# Altium project mcHF_ui.PrjPCB
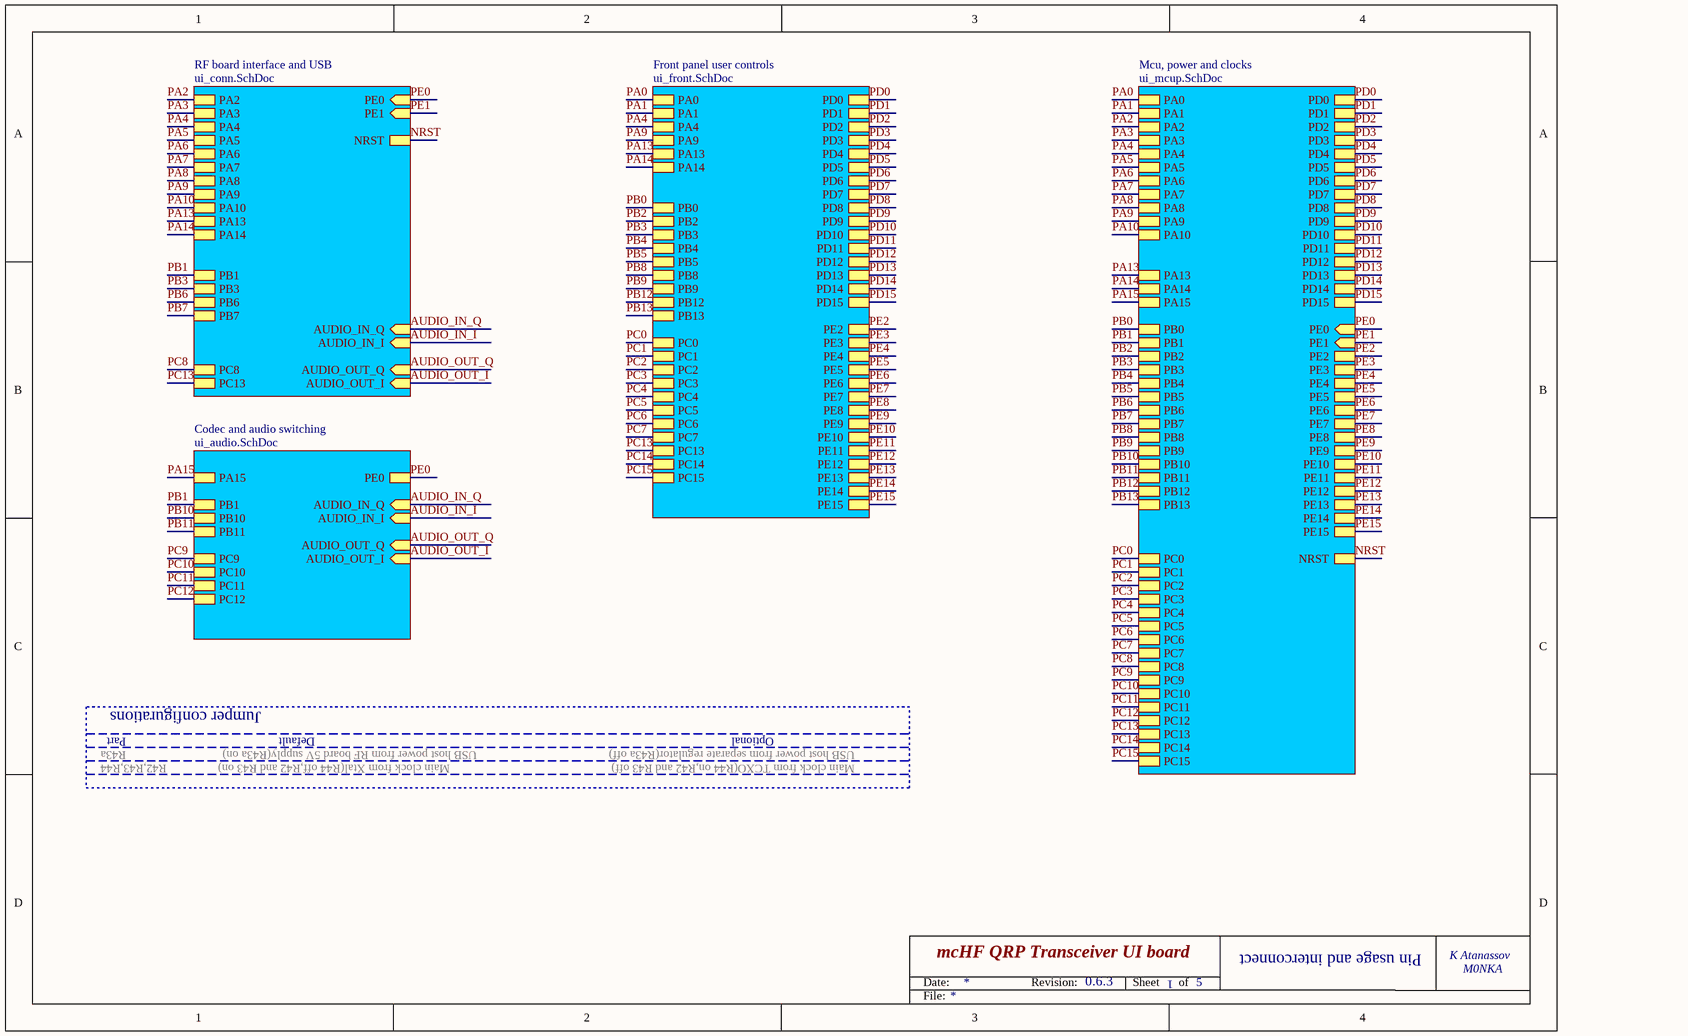
[diagram p0: ui_main.SchDoc]
4 sheets, 126 parts. Net scope: hierarchical (ports join the sheet entries above them; power ports are global).
Board file: ui_main.PcbDoc
Sheets:
  ui_main.SchDoc
    Mcu, power and clocks = ui_mcup.SchDoc
    RF board interface and USB = ui_conn.SchDoc
    Front panel user controls = ui_front.SchDoc

## Sheet ui_main.SchDoc: mcHF QRP Transceiver UI board
size A4; Author: K Atanassov; CompanyName: M0NKA; Revision: 0.6.3; SheetTotal: 5

### Sub-sheets
Codec and audio switching = ui_audio.SchDoc (file not in this document): PA15, PB1, PB10, PB11, PC9, PC11, PC10, PC12, PE0, AUDIO_IN_Q (in), AUDIO_IN_I (in), AUDIO_OUT_Q (in), AUDIO_OUT_I (in)
Front panel user controls = ui_front.SchDoc: PA0, PA1, PB3, PB2, PB0, PB8, PB9, PB12, PB13, PB4, PB5, PC0, PC1, PC2, PC3, PC4, PC5, PC6, PC7, PC13, PC14, PC15, PD0, PD1, PD2, PD3, PD4, PD5, PD6, PD7, PD8, PD9, PD10, PD12, PD11, PD13, PD14, PD15, PE2, PE3, PE4, PE5, PE6, PE7, PE8, PE9, PE10, PE11, PE12, PE13, PE14, PE15, PA13, PA14, PA4, PA9
Mcu, power and clocks = ui_mcup.SchDoc: PD0, PD1, PD2, PD3, PE1 (in), PD4, PD5, PD6, PD7, PD8, PD9, PD10, PD11, PD12, PD13, PD14, PD15, PE2, PE3, PE4, PE5, PE6, PE7, PE8, PE9, PE10, PE11, PE12, PE13, PE14, PE15, PA0, PA1, PA2, PA3, PA4, PA5, PA6, PA7, PA8, PA9, PA10, PA13, PA14, PA15, PE0 (in), PB0, PB1, PB3, PB4, PB5, PB6, PB8, PB7, PB9, PB10, PB11, PB12, PB13, PC1, PC0, PC2, PC3, PC4, PC5, PC6, PC7, PC8, PC9, PC10, PC11, PC12, PC13, PC14, PC15, PB2, NRST
RF board interface and USB = ui_conn.SchDoc: PA3, PA2, PA5, PA6, PA7, PA9, PB1, PA8, PB6, PB7, PC8, PE0 (in), PE1 (in), AUDIO_IN_Q (in), AUDIO_IN_I (in), AUDIO_OUT_Q (in), AUDIO_OUT_I (in), PA10, PC13, PA4, NRST, PA13, PA14, PB3

### Nets
AUDIO_IN_I: sheet Codec and audio switching/AUDIO_IN_I, sheet RF board interface and USB/AUDIO_IN_I
AUDIO_IN_Q: sheet Codec and audio switching/AUDIO_IN_Q, sheet RF board interface and USB/AUDIO_IN_Q
AUDIO_OUT_I: sheet Codec and audio switching/AUDIO_OUT_I, sheet RF board interface and USB/AUDIO_OUT_I
AUDIO_OUT_Q: sheet Codec and audio switching/AUDIO_OUT_Q, sheet RF board interface and USB/AUDIO_OUT_Q
NRST: sheet Mcu, power and clocks/NRST, sheet RF board interface and USB/NRST
PA0: sheet Mcu, power and clocks/PA0, sheet Front panel user controls/PA0
PA1: sheet Mcu, power and clocks/PA1, sheet Front panel user controls/PA1
PA2: sheet Mcu, power and clocks/PA2, sheet RF board interface and USB/PA2
PA3: sheet Mcu, power and clocks/PA3, sheet RF board interface and USB/PA3
PA4: sheet Mcu, power and clocks/PA4, sheet RF board interface and USB/PA4, sheet Front panel user controls/PA4
PA5: sheet Mcu, power and clocks/PA5, sheet RF board interface and USB/PA5
PA6: sheet Mcu, power and clocks/PA6, sheet RF board interface and USB/PA6
PA7: sheet Mcu, power and clocks/PA7, sheet RF board interface and USB/PA7
PA8: sheet Mcu, power and clocks/PA8, sheet RF board interface and USB/PA8
PA9: sheet Mcu, power and clocks/PA9, sheet RF board interface and USB/PA9, sheet Front panel user controls/PA9
PA10: sheet Mcu, power and clocks/PA10, sheet RF board interface and USB/PA10
PA13: sheet Mcu, power and clocks/PA13, sheet RF board interface and USB/PA13, sheet Front panel user controls/PA13
PA14: sheet Mcu, power and clocks/PA14, sheet RF board interface and USB/PA14, sheet Front panel user controls/PA14
PA15: sheet Mcu, power and clocks/PA15, sheet Codec and audio switching/PA15
PB0: sheet Mcu, power and clocks/PB0, sheet Front panel user controls/PB0
PB1: sheet Mcu, power and clocks/PB1, sheet Codec and audio switching/PB1, sheet RF board interface and USB/PB1
PB2: sheet Mcu, power and clocks/PB2, sheet Front panel user controls/PB2
PB3: sheet Mcu, power and clocks/PB3, sheet RF board interface and USB/PB3, sheet Front panel user controls/PB3
PB4: sheet Mcu, power and clocks/PB4, sheet Front panel user controls/PB4
PB5: sheet Mcu, power and clocks/PB5, sheet Front panel user controls/PB5
PB6: sheet Mcu, power and clocks/PB6, sheet RF board interface and USB/PB6
PB7: sheet Mcu, power and clocks/PB7, sheet RF board interface and USB/PB7
PB8: sheet Mcu, power and clocks/PB8, sheet Front panel user controls/PB8
PB9: sheet Mcu, power and clocks/PB9, sheet Front panel user controls/PB9
PB10: sheet Mcu, power and clocks/PB10, sheet Codec and audio switching/PB10
PB11: sheet Mcu, power and clocks/PB11, sheet Codec and audio switching/PB11
PB12: sheet Mcu, power and clocks/PB12, sheet Front panel user controls/PB12
PB13: sheet Mcu, power and clocks/PB13, sheet Front panel user controls/PB13  [project net LCD13]
PC0: sheet Mcu, power and clocks/PC0, sheet Front panel user controls/PC0
PC1: sheet Mcu, power and clocks/PC1, sheet Front panel user controls/PC1
PC2: sheet Mcu, power and clocks/PC2, sheet Front panel user controls/PC2  [project net LCD16]
PC3: sheet Mcu, power and clocks/PC3, sheet Front panel user controls/PC3  [project net LCD17]
PC4: sheet Mcu, power and clocks/PC4, sheet Front panel user controls/PC4
PC5: sheet Mcu, power and clocks/PC5, sheet Front panel user controls/PC5
PC6: sheet Mcu, power and clocks/PC6, sheet Front panel user controls/PC6
PC7: sheet Mcu, power and clocks/PC7, sheet Front panel user controls/PC7
PC8: sheet Mcu, power and clocks/PC8, sheet RF board interface and USB/PC8
PC9: sheet Mcu, power and clocks/PC9, sheet Codec and audio switching/PC9
PC10: sheet Mcu, power and clocks/PC10, sheet Codec and audio switching/PC10
PC11: sheet Mcu, power and clocks/PC11, sheet Codec and audio switching/PC11
PC12: sheet Mcu, power and clocks/PC12, sheet Codec and audio switching/PC12
PC13: sheet Mcu, power and clocks/PC13, sheet RF board interface and USB/PC13, sheet Front panel user controls/PC13
PC14: sheet Mcu, power and clocks/PC14, sheet Front panel user controls/PC14
PC15: sheet Mcu, power and clocks/PC15, sheet Front panel user controls/PC15
PD0: sheet Mcu, power and clocks/PD0, sheet Front panel user controls/PD0
PD1: sheet Mcu, power and clocks/PD1, sheet Front panel user controls/PD1
PD2: sheet Mcu, power and clocks/PD2, sheet Front panel user controls/PD2  [project net LCD40]
PD3: sheet Mcu, power and clocks/PD3, sheet Front panel user controls/PD3  [project net LCD15]
PD4: sheet Mcu, power and clocks/PD4, sheet Front panel user controls/PD4
PD5: sheet Mcu, power and clocks/PD5, sheet Front panel user controls/PD5
PD6: sheet Mcu, power and clocks/PD6, sheet Front panel user controls/PD6
PD7: sheet Mcu, power and clocks/PD7, sheet Front panel user controls/PD7  [project net LCD11]
PD8: sheet Mcu, power and clocks/PD8, sheet Front panel user controls/PD8
PD9: sheet Mcu, power and clocks/PD9, sheet Front panel user controls/PD9
PD10: sheet Mcu, power and clocks/PD10, sheet Front panel user controls/PD10
PD11: sheet Mcu, power and clocks/PD11, sheet Front panel user controls/PD11
PD12: sheet Mcu, power and clocks/PD12, sheet Front panel user controls/PD12
PD13: sheet Mcu, power and clocks/PD13, sheet Front panel user controls/PD13
PD14: sheet Mcu, power and clocks/PD14, sheet Front panel user controls/PD14
PD15: sheet Mcu, power and clocks/PD15, sheet Front panel user controls/PD15
PE0: sheet Mcu, power and clocks/PE0, sheet Codec and audio switching/PE0, sheet RF board interface and USB/PE0
PE1: sheet Mcu, power and clocks/PE1, sheet RF board interface and USB/PE1
PE2: sheet Mcu, power and clocks/PE2, sheet Front panel user controls/PE2
PE3: sheet Mcu, power and clocks/PE3, sheet Front panel user controls/PE3
PE4: sheet Mcu, power and clocks/PE4, sheet Front panel user controls/PE4
PE5: sheet Mcu, power and clocks/PE5, sheet Front panel user controls/PE5
PE6: sheet Mcu, power and clocks/PE6, sheet Front panel user controls/PE6
PE7: sheet Mcu, power and clocks/PE7, sheet Front panel user controls/PE7
PE8: sheet Mcu, power and clocks/PE8, sheet Front panel user controls/PE8
PE9: sheet Mcu, power and clocks/PE9, sheet Front panel user controls/PE9
PE10: sheet Mcu, power and clocks/PE10, sheet Front panel user controls/PE10
PE11: sheet Mcu, power and clocks/PE11, sheet Front panel user controls/PE11
PE12: sheet Mcu, power and clocks/PE12, sheet Front panel user controls/PE12
PE13: sheet Mcu, power and clocks/PE13, sheet Front panel user controls/PE13
PE14: sheet Mcu, power and clocks/PE14, sheet Front panel user controls/PE14
PE15: sheet Mcu, power and clocks/PE15, sheet Front panel user controls/PE15

### Notes on the sheet
- Jumper configurations
- Part
- R43a
- R42,R43,R44
- Default
- Main clock from Xtal(R44 off,R42 and R43 on)
- USB host power from RF board 5V supply(R43a on)
- Optional
- USB host power from separate regulator(R43a off)
- Main clock from TCXO(R44 on,R42 and R43 off)
- 1
- Pin usage and interconnect
- Date:
- Revision:
- Sheet
- of
- File:

## Sheet ui_mcup.SchDoc: mcHF QRP Transceiver UI board
size A4; Author: K Atanassov; CompanyName: M0NKA; Revision: 0.6.3; SheetTotal: 5
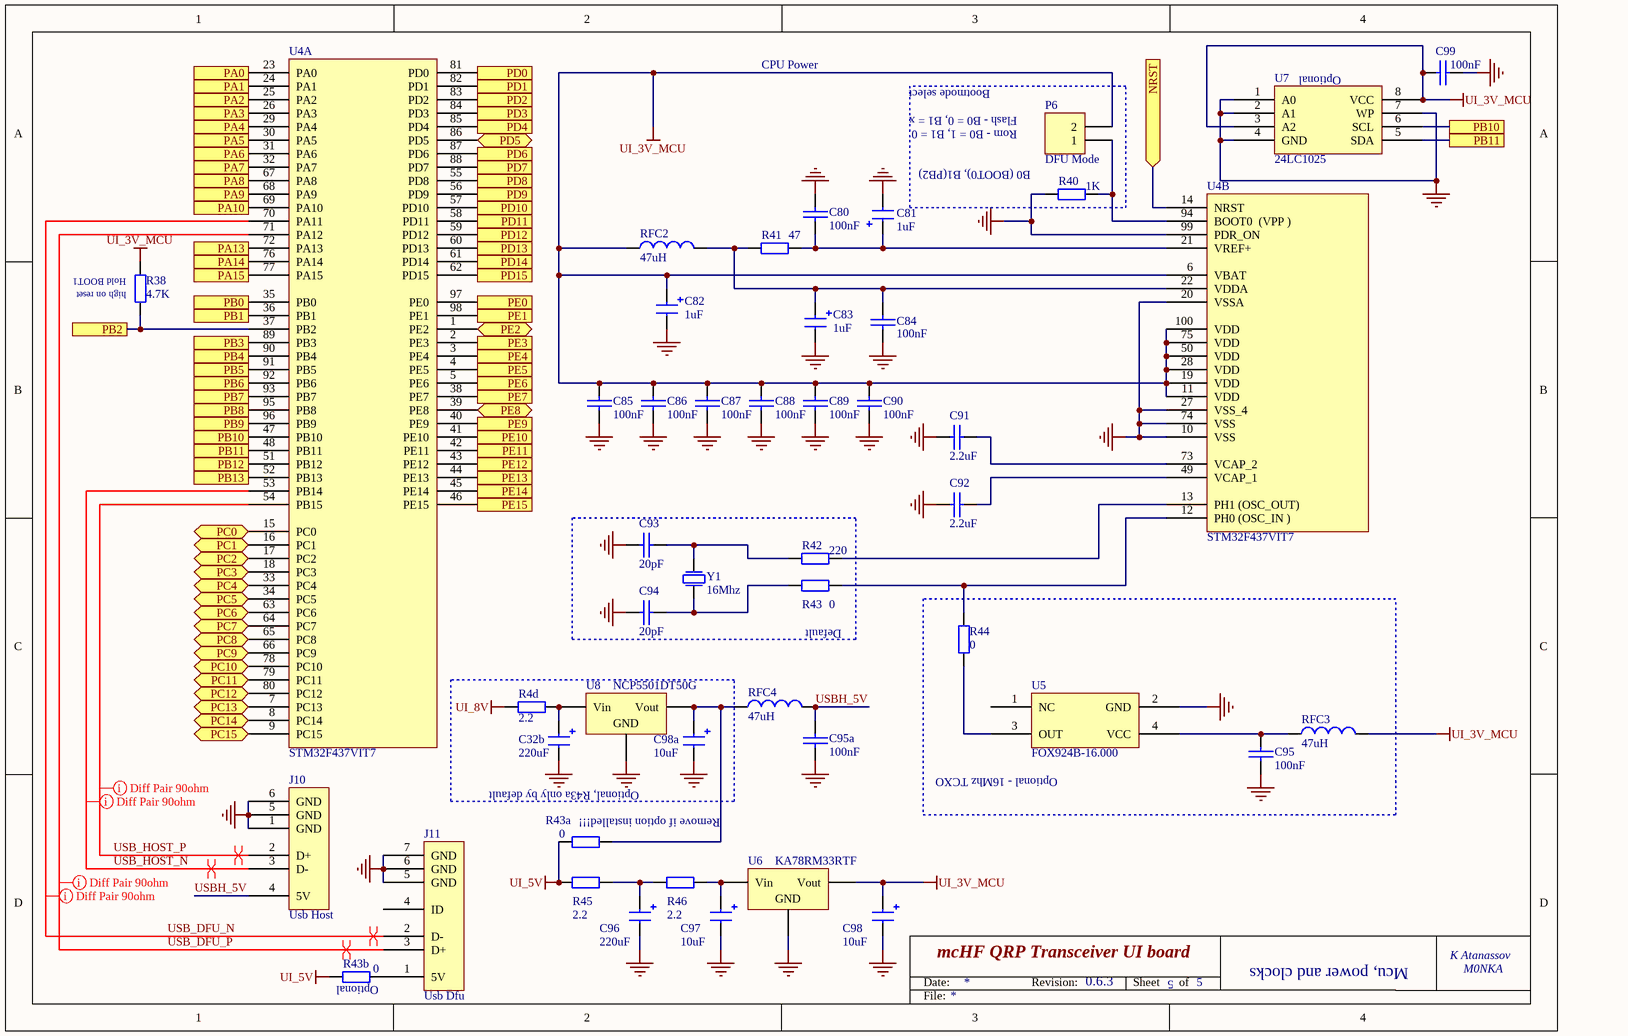
[diagram p1: ui_mcup.SchDoc]

### Parts
C32b  220uF  [CAP_ALUM]  (no BOM)
C80  100nF  [0805-Pro]
C81  1uF  [1206_ELEC_CAP_N]
C82  1uF  [1206_ELEC_CAP_N]
C83  1uF  [1206_ELEC_CAP_N]
C84  100nF  [0805-Pro]
C85  100nF  [0805-Pro]
C86  100nF  [0805-Pro]
C87  100nF  [0805-Pro]
C88  100nF  [0805-Pro]
C89  100nF  [0805-Pro]
C90  100nF  [0805-Pro]
C91  2.2uF  [0805-Pro]
C92  2.2uF  [0805-Pro]
C93  20pF  [0805-Pro]
C94  20pF  [0805-Pro]
C95  100nF  [0805-Pro]  (no BOM)
C95a  100nF  [0805-Pro]
C96  220uF  [CAP_ALUM]
C97  10uF  [1206_ELEC_CAP_N]
C98  10uF  [1206_ELEC_CAP_N]
C98a  10uF  [1206_ELEC_CAP_N]  (no BOM)
C99  100nF  [0805-Pro]
J10  Usb Host  [USB_OUT_A]
J11  Usb Dfu  [MINI_USB_B_SMD]
P6  DFU Mode  [SIP2]
R4d  2.2  [1206]  (no BOM)
R38  4.7K  [0805-Pro]
R40  1K  [0805-Pro]
R41  47  [0805-Pro]
R42  220  [0805-Pro]
R43  0  [0805-Pro]
R43a  0  [0805-Pro]
R43b  0  [0805-Pro]
R44  0  [0805-Pro]  (no BOM)
R45  2.2  [1206]
R46  2.2  [1206]
RFC2  47uH  [0805-Pro]
RFC3  47uH  [0805-Pro]  (no BOM)
RFC4  47uH  [0805-Pro]
U4  STM32F437VIT7  [SQFP14X14-100-Pro]  (parts A,B of 2)
U5  FOX924B-16.000  [2SMX-3SMXB]  (no BOM)
U6  KA78RM33RTF  [TO-252]
U7  24LC1025  [SO-8-Pro]
U8  NCP5501DT50G  [TO-252]  (no BOM)
Y1  16Mhz  [HC49/4H_SMX]

### Blocks framed on the sheet
Default: C93 C94 R42 R43 Y1
Optional - 16Mhz TCXO: C95 R44 RFC3 U5
Optional, R43a only by default: C32b C98a R4d U8

### Ports
NRST (in), PA0, PA1, PA2, PA3, PA4, PA5, PA6, PA7, PA8, PA9, PA10, PA13, PA14, PA15, PB0, PB1, PB2, PB3, PB4, PB5, PB6, PB7, PB8, PB9, PB10, PB11, PB12, PB13, PC0 (bidir), PC1 (bidir), PC2 (bidir), PC3 (bidir), PC4 (bidir), PC5 (bidir), PC6 (bidir), PC7 (bidir), PC8 (bidir), PC9 (bidir), PC10 (bidir), PC11 (bidir), PC12 (bidir), PC13 (bidir), PC14 (bidir), PC15 (bidir), PD0, PD1, PD2, PD3, PD4, PD5 (bidir), PD6, PD7, PD8, PD9, PD10, PD11, PD12, PD13, PD14, PD15, PE0, PE1, PE2 (bidir), PE3, PE4, PE5, PE6, PE7, PE8 (bidir), PE9, PE10, PE11, PE12, PE13, PE14, PE15

### Nets
GND: C32b.2 C80.2 C81.2 C82.2 C83.2 C84.1 C85.1 C86.1 C87.1 C88.1 C89.1 C90.1 C91.1 C92.1 C93.1 C94.1 C95.1 C95a.1 C96.2 C97.2 C98.2 C98a.2 C99.2 J10.1(GND) J10.5(GND) J10.6(GND) J11.5(GND) J11.6(GND) J11.7(GND) R40.1 U4.10(VSS) U4.20(VSSA) U4.27(VSS_4) U4.74(VSS) U4.99(PDR_ON) U5.2(GND) U6.2(GND) U7.1(A0) U7.2(A1) U7.4(GND) U7.7(WP) U8.2(GND)
UI_3V_MCU: C82.1 C85.2 C86.2 C87.2 C88.2 C89.2 C90.2 C98.1 C99.1 P6.2 R38.1 RFC2.1 RFC3.2 U4.6(VBAT) U4.11(VDD) U4.19(VDD) U4.28(VDD) U4.50(VDD) U4.75(VDD) U4.100(VDD) U6.3(Vout) U7.3(A2) U7.8(VCC)
UI_5V: R43a.1 R43b.1 R45.1
UI_8V: R4d.1
LCD11: U4.88(PD7) ; port PD7
LCD13: U4.52(PB13) ; port PB13
LCD15: U4.84(PD3) ; port PD3
LCD16: U4.17(PC2) ; port PC2
LCD17: U4.18(PC3) ; port PC3
LCD40: U4.83(PD2) ; port PD2
NRST: U4.14(NRST) ; port NRST
PA0: U4.23(PA0) ; port PA0
PA1: U4.24(PA1) ; port PA1
PA2: U4.25(PA2) ; port PA2
PA3: U4.26(PA3) ; port PA3
PA4: U4.29(PA4) ; port PA4
PA5: U4.30(PA5) ; port PA5
PA6: U4.31(PA6) ; port PA6
PA7: U4.32(PA7) ; port PA7
PA8: U4.67(PA8) ; port PA8
PA9: U4.68(PA9) ; port PA9
PA10: U4.69(PA10) ; port PA10
PA13: U4.72(PA13) ; port PA13
PA14: U4.76(PA14) ; port PA14
PA15: U4.77(PA15) ; port PA15
PB0: U4.35(PB0) ; port PB0
PB1: U4.36(PB1) ; port PB1
PB2: R38.2 U4.37(PB2) ; port PB2
PB3: U4.89(PB3) ; port PB3
PB4: U4.90(PB4) ; port PB4
PB5: U4.91(PB5) ; port PB5
PB6: U4.92(PB6) ; port PB6
PB7: U4.93(PB7) ; port PB7
PB8: U4.95(PB8) ; port PB8
PB9: U4.96(PB9) ; port PB9
PB10: U4.47(PB10) U7.6(SCL) ; port PB10
PB11: U4.48(PB11) U7.5(SDA) ; port PB11
PB12: U4.51(PB12) ; port PB12
PC0: U4.15(PC0) ; port PC0
PC1: U4.16(PC1) ; port PC1
PC4: U4.33(PC4) ; port PC4
PC5: U4.34(PC5) ; port PC5
PC6: U4.63(PC6) ; port PC6
PC7: U4.64(PC7) ; port PC7
PC8: U4.65(PC8) ; port PC8
PC9: U4.66(PC9) ; port PC9
PC10: U4.78(PC10) ; port PC10
PC11: U4.79(PC11) ; port PC11
PC12: U4.80(PC12) ; port PC12
PC13: U4.7(PC13) ; port PC13
PC14: U4.8(PC14) ; port PC14
PC15: U4.9(PC15) ; port PC15
PD0: U4.81(PD0) ; port PD0
PD1: U4.82(PD1) ; port PD1
PD4: U4.85(PD4) ; port PD4
PD5: U4.86(PD5) ; port PD5
PD6: U4.87(PD6) ; port PD6
PD8: U4.55(PD8) ; port PD8
PD9: U4.56(PD9) ; port PD9
PD10: U4.57(PD10) ; port PD10
PD11: U4.58(PD11) ; port PD11
PD12: U4.59(PD12) ; port PD12
PD13: U4.60(PD13) ; port PD13
PD14: U4.61(PD14) ; port PD14
PD15: U4.62(PD15) ; port PD15
PE0: U4.97(PE0) ; port PE0
PE1: U4.98(PE1) ; port PE1
PE2: U4.1(PE2) ; port PE2
PE3: U4.2(PE3) ; port PE3
PE4: U4.3(PE4) ; port PE4
PE5: U4.4(PE5) ; port PE5
PE6: U4.5(PE6) ; port PE6
PE7: U4.38(PE7) ; port PE7
PE8: U4.39(PE8) ; port PE8
PE9: U4.40(PE9) ; port PE9
PE10: U4.41(PE10) ; port PE10
PE11: U4.42(PE11) ; port PE11
PE12: U4.43(PE12) ; port PE12
PE13: U4.44(PE13) ; port PE13
PE14: U4.45(PE14) ; port PE14
PE15: U4.46(PE15) ; port PE15
USB_DFU_N: J11.2(D-) U4.70(PA11)
USB_DFU_P: J11.3(D+) U4.71(PA12)
USB_HOST_N: J10.3(D-) U4.53(PB14)
USB_HOST_P: J10.2(D+) U4.54(PB15)
USBH_5V: C95a.2 J10.4(5V) RFC4.2
NetC32b_1: C32b.1 R4d.2 U8.1(Vin)
NetC80_1: C80.1 C81.1 R41.2 U4.21(VREF+)
NetC83_1: C83.1 C84.2 R41.1 RFC2.2 U4.22(VDDA)
NetC91_2: C91.2 U4.73(VCAP_2)
NetC92_2: C92.2 U4.49(VCAP_1)
NetC93_2: C93.2 R42.1 Y1.1(P1)
NetC94_2: C94.2 R43.1 Y1.2(P2)
NetC95_2: C95.2 RFC3.1 U5.4(VCC)
NetC96_1: C96.1 R45.2 R46.1
NetC97_1: C97.1 R46.2 U6.1(Vin)
NetC98a_1: C98a.1 R43a.2 RFC4.1 U8.3(Vout)
NetJ11_1: J11.1(5V) R43b.2
NetP6_1: P6.1 R40.2 U4.94(BOOT0__(VPP_))
NetR42_2: R42.2 U4.13(PH1_(OSC_OUT))
NetR43_2: R43.2 R44.2 U4.12(PH0_(OSC_IN_))
NetR44_1: R44.1 U5.3(OUT)

Not connected (* = marked no-connect by the designer): J11 4(ID); U5 1(NC)

### Layout directives
differential pair: USB_DFU_N, USB_DFU_P, USB_HOST_N, USB_HOST_P
rule Matched Net Lengths [Tolerance = 150mil]: USB_DFU_N, USB_DFU_P, USB_HOST_N, USB_HOST_P

### Notes on the sheet
- CPU Power
- Bootmode select
- Flash - B0 = 0, B1 = x
- (near U7) Optional
- Rom - B0 = 1, B1 = 0
- B0 (BOOT0), B1(PB2)
- (near R38) Hold BOOT1
- (near R38) high on reset
- (near R43a) Remove if option installed!!!
- (near R43b) Optional
- 5
- Mcu, power and clocks
- Date:
- Revision:
- Sheet
- of
- File:

### Library data of the parts
C32b C96 = CAP-POL: Electrolitic capacitor; Order: FN 225-4321; QT Order: QCC-00320; Price: 0.34
C80 C84-C90 C95 C95a C99 = CAP: Capacitor; Order: FN 174-0673; QT Order: QCC-00154; Price: 0.068
C81-C83 = CAP-POL: Electrolitic capacitor; Order: FN 145-7406; QT Order: QCC-00165; Price: 0.235
C91 C92 = CAP: Capacitor; Order: FN 184-5751; QT Order: QCC-00103; Price: 0.115
C93 C94 = CAP: Capacitor; Order: FN 233-2762; Checked: NA; Price: 0.094
C97 C98 C98a = CAP-POL: Electrolitic capacitor; Order: FN 233-3009; QT Order: QCC-00166; Price: 0.204
J10 = USB_OUT: USB Host Connector; Order: FN 117-7883; Price: 0.60
J11 = MINI_USB_B: Mini USB connector; Order: FN 211-2367; QT Order: QCJ-00083; Price: 0.62
P6 = Header 2: Header, 2-Pin; Order: NA; Price: 0; Checked: NA
R4d R45 R46 = RES: Resistor; Order: FN 207-8984; QT Order: QCR-00412; Price: 0.02
R38 = RES: Resistor; Order: FN 200-8383; QT Order: QCR-00341; Price: 0.024
R40 = RES: Resistor; Order: FN 157-6459; QT Order: QCR-00326; Price: 0.061
R41 = RES: Resistor; Order: FN 173-8942; QT Order: QCR-00293; Price: 0.052
R42 = RES: Resistor; Order: FN 933-2804; QT Order: QCR-00309; Price: 0.007
R43 R43a R43b R44 = RES: Resistor; Order: FN 933-3681; QT Order: QCR-00268; Price: 0.009
RFC2-RFC4 = Inductor: Order: FN 166-9895; Price: 0.16
U4 = STM32F40x-VG: STM32F4 controller; Order: FN 233-3297; Price: 8.07
U5 = FOX924B-16.000: TCXO; Order: FN 206-3959; Price: 2.77
U6 = UA78M33CKVURG3: VOLT REG, 3.3V, TO-252; Order: FN 245-1041; Price: 0.39
U7 = 24LC01B: 1K I2C Eeprom; Order: FN 133-1323; QT Order: QCI-00053; Price: 2.81
U8 = MC7805BTG: VOLTAGE REG, 40V, TO220-3; Order: FN 170-3369; Price: 0.53
Y1 = XTAL: Crystal Oscillator; Order: FN 971-3808; Checked: NA; Price: 0.51

## Sheet ui_conn.SchDoc: mcHF QRP Transceiver UI board
size A4; Author: K Atanassov; CompanyName: M0NKA; Revision: 0.6.3; SheetTotal: 5
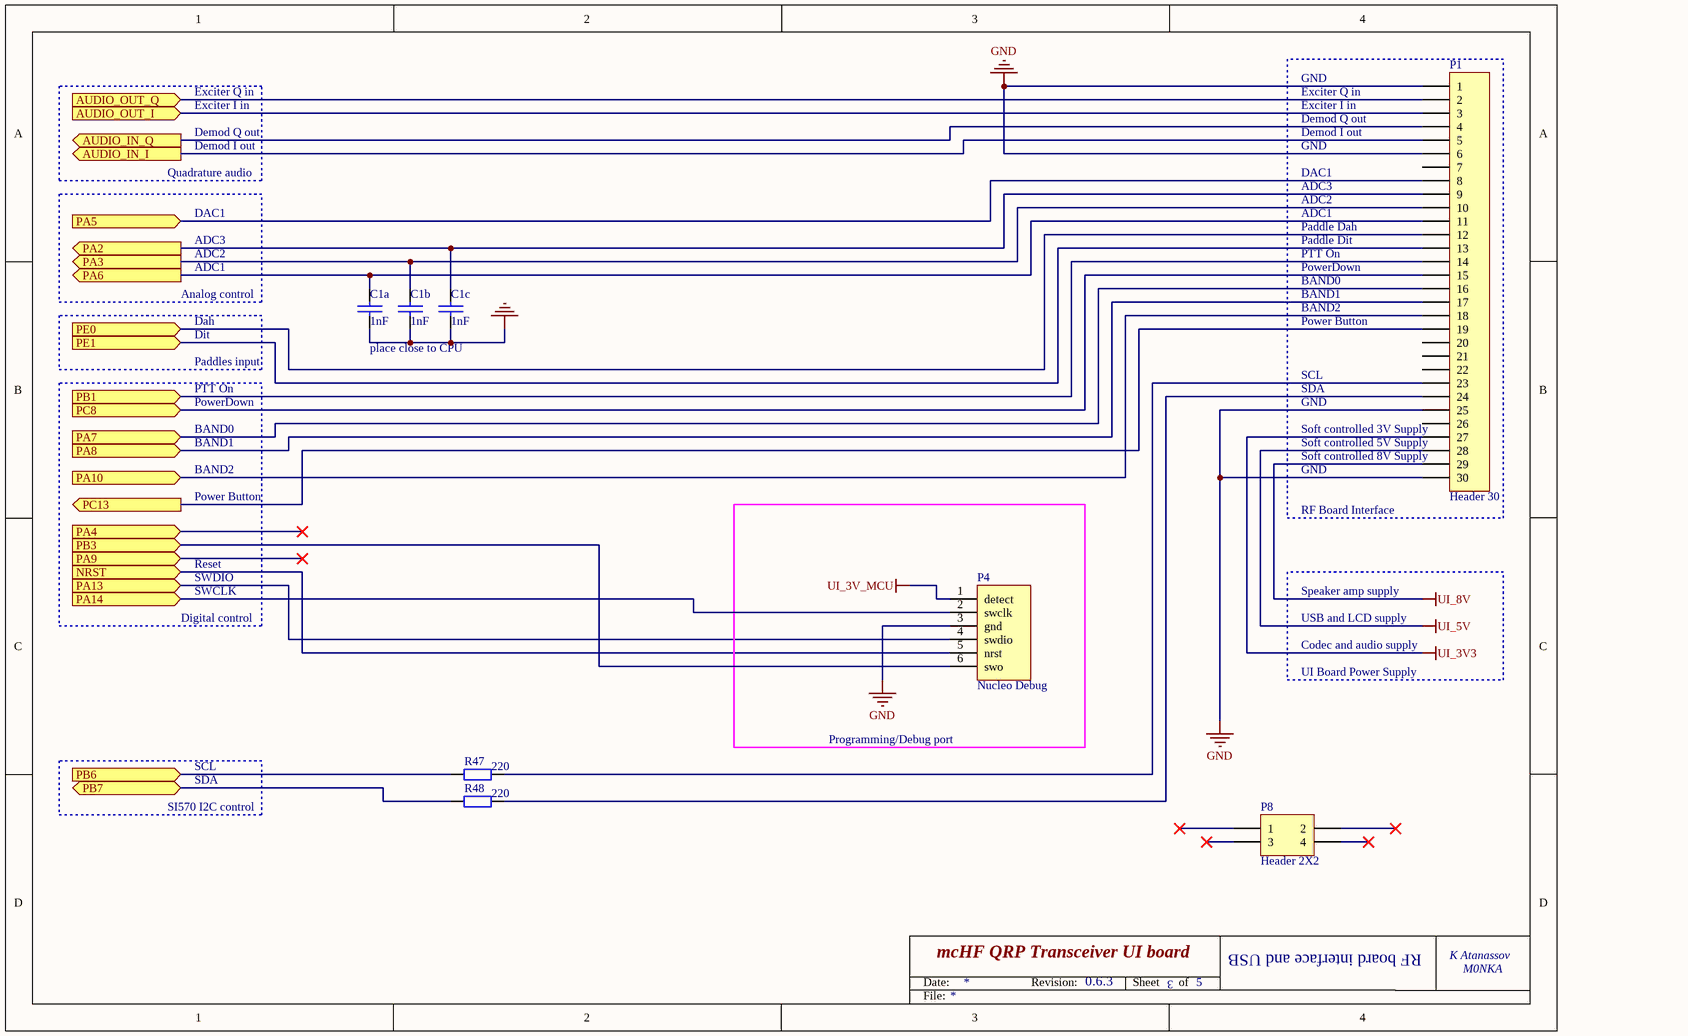
[diagram p2: ui_conn.SchDoc]

### Parts
C1a  1nF  [0805-Pro]
C1b  1nF  [0805-Pro]
C1c  1nF  [0805-Pro]
P1  Header 30  [HDR1X30]
P4  Nucleo Debug  [HDR1X6]  (no BOM)
P8  Header 2X2  [HDR2X2]
R47  220  [0805-Pro]
R48  220  [0805-Pro]

### Blocks framed on the sheet
Programming/Debug port: P4

### Ports
AUDIO_IN_I (out), AUDIO_IN_Q (out), AUDIO_OUT_I (in), AUDIO_OUT_Q (in), NRST (in), PA2 (out), PA3 (out), PA4 (in), PA5 (in), PA6 (out), PA7 (in), PA8 (in), PA9 (in), PA10 (in), PA13 (in), PA14 (in), PB1 (in), PB3 (in), PB6 (in), PB7 (bidir), PC8 (in), PC13 (out), PE0 (in), PE1 (in)

### Nets
GND: C1a.2 C1b.2 C1c.2 P1.1 P1.6 P1.25 P1.30 P4.3(gnd)
UI_3V3: P1.27
UI_3V_MCU: P4.1(detect)
UI_5V: P1.28
UI_8V: P1.29
AUDIO_IN_I: P1.5 ; port AUDIO_IN_I
AUDIO_IN_Q: P1.4 ; port AUDIO_IN_Q
AUDIO_OUT_I: P1.3 ; port AUDIO_OUT_I
AUDIO_OUT_Q: P1.2 ; port AUDIO_OUT_Q
NRST: P4.5(nrst) ; port NRST
PA2: C1c.1 P1.9 ; port PA2
PA3: C1b.1 P1.10 ; port PA3
PA5: P1.8 ; port PA5
PA6: C1a.1 P1.11 ; port PA6
PA7: P1.16 ; port PA7
PA8: P1.17 ; port PA8
PA10: P1.18 ; port PA10
PA13: P4.4(swdio) ; port PA13
PA14: P4.2(swclk) ; port PA14
PB1: P1.14 ; port PB1
PB3: P4.6(swo) ; port PB3
PB6: R47.1 ; port PB6
PB7: R48.1 ; port PB7
PC8: P1.15 ; port PC8
PC13: P1.19 ; port PC13
PE0: P1.12 ; port PE0
PE1: P1.13 ; port PE1
NetP1_23: P1.23 R47.2
NetP1_24: P1.24 R48.2

Not connected (* = marked no-connect by the designer): P1 7 20 21 22 26; P8 1* 2* 3* 4*

### Notes on the sheet
- Exciter Q in
- Exciter I in
- GND
- Quadrature audio
- Demod Q out
- Demod I out
- DAC1
- ADC3
- ADC2
- ADC1
- Paddle Dit
- Paddle Dah
- Analog control
- PTT On
- PowerDown
- BAND0
- BAND1
- BAND2
- Dit
- Dah
- Paddles input
- place close to CPU
- SCL
- Power Button
- SDA
- (near P1) Soft controlled 3V Supply
- (near P1) Soft controlled 5V Supply
- (near P1) RF Board Interface
- (near P1) Soft controlled 8V Supply
- SWDIO
- Reset
- Digital control
- SWCLK
- Speaker amp supply
- USB and LCD supply
- Codec and audio supply
- UI Board Power Supply
- SI570 I2C control
- 3
- RF board interface and USB
- Date:
- Revision:
- Sheet
- of
- File:

### Library data of the parts
C1a C1b C1c = CAP: Capacitor; Order: FN 185-6408; QT Order: QCC-00259; Price: 0.01
P1 = Header 30: Header, 30-Pin; Order: NA; Price: 0.295
P4 = Nucleo_6: ST Nucleo 6 pin header
P8 = Header 2X2: Header, 2-Pin, Dual row; LatestRevisionDate: 17-Jul-2002; LatestRevisionNote: Re-released for DXP Platform.; Publisher: Altium Limited
R47 R48 = RES: as R42 on sheet ui_mcup; Price: 0.007

## Sheet ui_front.SchDoc: mcHF QRP Transceiver UI board
size A4; Author: K Atanassov; CompanyName: M0NKA; Revision: 0.6.3; SheetTotal: 5
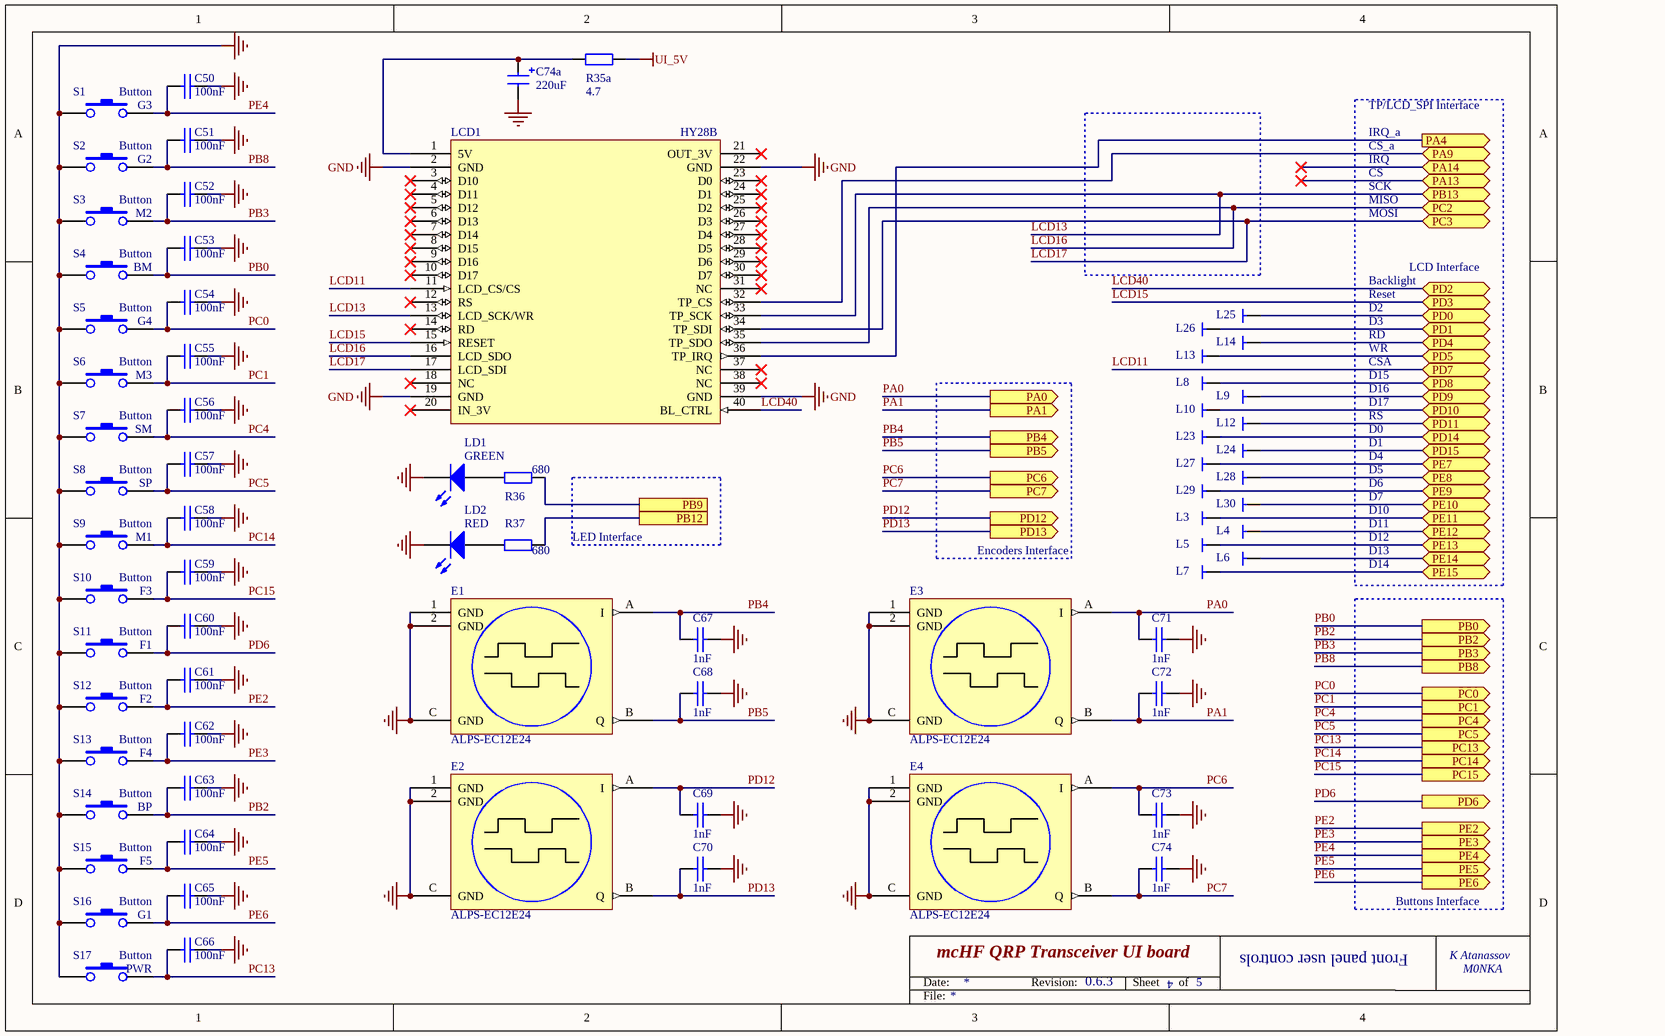
[diagram p3: ui_front.SchDoc]

### Parts
C50  100nF  [0805-Pro]
C51  100nF  [0805-Pro]
C52  100nF  [0805-Pro]
C53  100nF  [0805-Pro]
C54  100nF  [0805-Pro]
C55  100nF  [0805-Pro]
C56  100nF  [0805-Pro]
C57  100nF  [0805-Pro]
C58  100nF  [0805-Pro]
C59  100nF  [0805-Pro]
C60  100nF  [0805-Pro]
C61  100nF  [0805-Pro]
C62  100nF  [0805-Pro]
C63  100nF  [0805-Pro]
C64  100nF  [0805-Pro]
C65  100nF  [0805-Pro]
C66  100nF  [0805-Pro]
C67  1nF  [0805-Pro]
C68  1nF  [0805-Pro]
C69  1nF  [0805-Pro]
C70  1nF  [0805-Pro]
C71  1nF  [0805-Pro]
C72  1nF  [0805-Pro]
C73  1nF  [0805-Pro]
C74  1nF  [0805-Pro]
C74a  220uF  [CAP_ALUM]
E1  ALPS-EC12E24  [Encoder]
E2  ALPS-EC12E24  [Encoder]
E3  ALPS-EC12E24  [Encoder]
E4  ALPS-EC12E24  [Encoder]
L3  TP  [tp]  (value not drawn)  (no BOM)
L4  TP  [tp]  (value not drawn)  (no BOM)
L5  TP  [tp]  (value not drawn)  (no BOM)
L6  TP  [tp]  (value not drawn)  (no BOM)
L7  TP  [tp]  (value not drawn)  (no BOM)
L8  TP  [tp]  (value not drawn)  (no BOM)
L9  TP  [tp]  (value not drawn)  (no BOM)
L10  TP  [tp]  (value not drawn)  (no BOM)
L12  TP  [tp]  (value not drawn)  (no BOM)
L13  TP  [tp]  (value not drawn)  (no BOM)
L14  TP  [tp]  (value not drawn)  (no BOM)
L23  TP  [tp]  (value not drawn)  (no BOM)
L24  TP  [tp]  (value not drawn)  (no BOM)
L25  TP  [tp]  (value not drawn)  (no BOM)
L26  TP  [tp]  (value not drawn)  (no BOM)
L27  TP  [tp]  (value not drawn)  (no BOM)
L28  TP  [tp]  (value not drawn)  (no BOM)
L29  TP  [tp]  (value not drawn)  (no BOM)
L30  TP  [tp]  (value not drawn)  (no BOM)
LCD1  HY28B  [HY28A]  (no BOM)
LD1  GREEN  [LED2n]
LD2  RED  [LED2n]
R35a  4.7  [1206]
R36  680  [0805-Pro]
R37  680  [0805-Pro]
S1  Button  Software function: G3  [BUTTON_SMD2]
S2  Button  Software function: G2  [BUTTON_SMD2]
S3  Button  Software function: M2  [BUTTON_SMD2]
S4  Button  Software function: BM  [BUTTON_SMD2]
S5  Button  Software function: G4  [BUTTON_SMD2]
S6  Button  Software function: M3  [BUTTON_SMD2]
S7  Button  Software function: SM  [BUTTON_SMD2]
S8  Button  Software function: SP  [BUTTON_SMD2]
S9  Button  Software function: M1  [BUTTON_SMD2]
S10  Button  Software function: F3  [BUTTON_SMD2]
S11  Button  Software function: F1  [BUTTON_SMD2]
S12  Button  Software function: F2  [BUTTON_SMD2]
S13  Button  Software function: F4  [BUTTON_SMD2]
S14  Button  Software function: BP  [BUTTON_SMD2]
S15  Button  Software function: F5  [BUTTON_SMD2]
S16  Button  Software function: G1  [BUTTON_SMD2]
S17  Button  Software function: PWR  [BUTTON_SMD2]

### Ports
PA0 (out), PA1 (out), PA4 (out), PA9 (bidir), PA13 (bidir), PA14 (bidir), PB0 (out), PB2 (out), PB3 (out), PB4 (out), PB5 (out), PB8 (out), PB9, PB12, PB13 (bidir), PC0 (out), PC1 (out), PC2 (bidir), PC3 (bidir), PC4 (out), PC5 (out), PC6 (out), PC7 (out), PC13 (out), PC14 (out), PC15 (out), PD0 (bidir), PD1 (bidir), PD2 (bidir), PD3 (bidir), PD4 (bidir), PD5 (bidir), PD6 (out), PD7 (bidir), PD8 (bidir), PD9 (bidir), PD10 (bidir), PD11 (bidir), PD12 (out), PD13 (out), PD14 (bidir), PD15 (bidir), PE2 (out), PE3 (out), PE4 (out), PE5 (out), PE6 (out), PE7 (bidir), PE8 (bidir), PE9 (bidir), PE10 (bidir), PE11 (bidir), PE12 (bidir), PE13 (bidir), PE14 (bidir), PE15 (bidir)

### Nets
GND: C50.1 C51.1 C52.1 C53.1 C54.1 C55.1 C56.1 C57.1 C58.1 C59.1 C60.1 C61.1 C62.1 C63.1 C64.1 C65.1 C66.1 C67.2 C68.2 C69.2 C70.2 C71.2 C72.2 C73.2 C74.2 C74a.2 E1.1(GND) E1.2(GND) E1.C(GND) E2.1(GND) E2.2(GND) E2.C(GND) E3.1(GND) E3.2(GND) E3.C(GND) E4.1(GND) E4.2(GND) E4.C(GND) LCD1.2(GND) LCD1.19(GND) LCD1.22(GND) LCD1.39(GND) LD1.2(K) LD2.2(K) S1.1 S2.1 S3.1 S4.1 S5.1 S6.1 S7.1 S8.1 S9.1 S10.1 S11.1 S12.1 S13.1 S14.1 S15.1 S16.1 S17.1
UI_5V: R35a.1
LCD11: LCD1.11(LCD_CS/CS) ; port PD7
LCD13: LCD1.13(LCD_SCK/WR) LCD1.33(TP_SCK) ; port PB13
LCD15: LCD1.15(RESET) ; port PD3
LCD16: LCD1.16(LCD_SDO) LCD1.35(TP_SDO) ; port PC2
LCD17: LCD1.17(LCD_SDI) LCD1.34(TP_SDI) ; port PC3
LCD40: LCD1.40(BL_CTRL) ; port PD2
PA0: C71.1 E3.A(I) ; port PA0
PA1: C72.1 E3.B(Q) ; port PA1
PA4: LCD1.36(TP_IRQ) ; port PA4
PA9: LCD1.32(TP_CS) ; port PA9
PB0: C53.2 S4.2 ; port PB0
PB2: C63.2 S14.2 ; port PB2
PB3: C52.2 S3.2 ; port PB3
PB4: C67.1 E1.A(I) ; port PB4
PB5: C68.1 E1.B(Q) ; port PB5
PB8: C51.2 S2.2 ; port PB8
PB9: R36.2 ; port PB9
PB12: R37.2 ; port PB12
PC0: C54.2 S5.2 ; port PC0
PC1: C55.2 S6.2 ; port PC1
PC4: C56.2 S7.2 ; port PC4
PC5: C57.2 S8.2 ; port PC5
PC6: C73.1 E4.A(I) ; port PC6
PC7: C74.1 E4.B(Q) ; port PC7
PC13: C66.2 S17.2 ; port PC13
PC14: C58.2 S9.2 ; port PC14
PC15: C59.2 S10.2 ; port PC15
PD0: L25.1 ; port PD0
PD1: L26.1 ; port PD1
PD4: L14.1 ; port PD4
PD5: L13.1 ; port PD5
PD6: C60.2 S11.2 ; port PD6
PD8: L8.1 ; port PD8
PD9: L9.1 ; port PD9
PD10: L10.1 ; port PD10
PD11: L12.1 ; port PD11
PD12: C69.1 E2.A(I) ; port PD12
PD13: C70.1 E2.B(Q) ; port PD13
PD14: L23.1 ; port PD14
PD15: L24.1 ; port PD15
PE2: C61.2 S12.2 ; port PE2
PE3: C62.2 S13.2 ; port PE3
PE4: C50.2 S1.2 ; port PE4
PE5: C64.2 S15.2 ; port PE5
PE6: C65.2 S16.2 ; port PE6
PE7: L27.1 ; port PE7
PE8: L28.1 ; port PE8
PE9: L29.1 ; port PE9
PE10: L30.1 ; port PE10
PE11: L3.1 ; port PE11
PE12: L4.1 ; port PE12
PE13: L5.1 ; port PE13
PE14: L6.1 ; port PE14
PE15: L7.1 ; port PE15
NetC74a_1: C74a.1 LCD1.1(5V) R35a.2
NetLD1_1: LD1.1(A) R36.1
NetLD2_1: LD2.1(A) R37.1

Not connected (* = marked no-connect by the designer): LCD1 3(D10)* 4(D11)* 5(D12)* 6(D13)* 7(D14)* 8(D15)* 9(D16)* 10(D17)* 12(RS)* 14(RD)* 18(NC)* 20(IN_3V)* 21(OUT_3V)* 23(D0)* 24(D1)* 25(D2)* 26(D3)* 27(D4)* 28(D5)* 29(D6)* 30(D7)* 31(NC)* 37(NC)* 38(NC)*

### Notes on the sheet
- TP/LCD_SPI Interface
- IRQ
- CS
- IRQ_a
- CS_a
- MISO
- MOSI
- SCK
- D2
- Backlight
- Reset
- LCD Interface
- D15
- CSA
- WR
- RD
- D3
- D16
- D17
- RS
- D0
- D1
- D10
- D4
- D5
- D6
- D7
- (near R37) LED Interface
- Encoders Interface
- D12
- D11
- D13
- D14
- Buttons Interface
- 4
- Front panel user controls
- Date:
- Revision:
- Sheet
- of
- File:

### Library data of the parts
C50-C66 = CAP: as C80 on sheet ui_mcup; Price: 0.068
C67-C74 = CAP: as C1a on sheet ui_conn; Price: 0.01
C74a = CAP-POL: as C32b on sheet ui_mcup; Price: 0.34
E1-E4 = Encoder: ALPS Rotary Encoder; Order: FN 152-0812; Price: 1.00
L3-L10 L12-L14 L23-L30 = TP: Test point
LCD1 = HY28AB: 2.8 inch TFT LCD
LD1 = LED2: LED 3mm; Order: FN 211-2096; Revision: July-2002: Re-released for DXP Platform.; Price: 0.116
LD2 = LED2: LED 3mm; Order: FN 211-2100; Revision: July-2002: Re-released for DXP Platform.; Price: 0.148
R35a = RES: Resistor; Order: FN 207-8986; QT Order: QCR-00415; Price: 0.02
R36 R37 = RES: Resistor; Order: FN 933-3460; QT Order: QCR-00321; Price: 0.054
S1-S17 = SW-PB: Push Button; Order: EB 290913735944; Price: 0.14

## Nets that join several sheets
GND: ui_mcup (42 pins), ui_conn (8 pins), ui_front (61 pins)
UI_3V_MCU: ui_mcup (23 pins), ui_conn (P4.1)
UI_5V: ui_mcup (R43a.1 R43b.1 R45.1), ui_conn (P1.28), ui_front (R35a.1)
UI_8V: ui_mcup (R4d.1), ui_conn (P1.29)
LCD11: ui_mcup (U4.88), ui_front (LCD1.11)
LCD13: ui_mcup (U4.52), ui_front (LCD1.13 LCD1.33)
LCD15: ui_mcup (U4.84), ui_front (LCD1.15)
LCD16: ui_mcup (U4.17), ui_front (LCD1.16 LCD1.35)
LCD17: ui_mcup (U4.18), ui_front (LCD1.17 LCD1.34)
LCD40: ui_mcup (U4.83), ui_front (LCD1.40)
NRST: ui_mcup (U4.14), ui_conn (P4.5)
PA0: ui_mcup (U4.23), ui_front (C71.1 E3.A)
PA1: ui_mcup (U4.24), ui_front (C72.1 E3.B)
PA2: ui_mcup (U4.25), ui_conn (C1c.1 P1.9)
PA3: ui_mcup (U4.26), ui_conn (C1b.1 P1.10)
PA4: ui_mcup (U4.29), ui_front (LCD1.36)
PA5: ui_mcup (U4.30), ui_conn (P1.8)
PA6: ui_mcup (U4.31), ui_conn (C1a.1 P1.11)
PA7: ui_mcup (U4.32), ui_conn (P1.16)
PA8: ui_mcup (U4.67), ui_conn (P1.17)
PA9: ui_mcup (U4.68), ui_front (LCD1.32)
PA10: ui_mcup (U4.69), ui_conn (P1.18)
PA13: ui_mcup (U4.72), ui_conn (P4.4)
PA14: ui_mcup (U4.76), ui_conn (P4.2)
PB0: ui_mcup (U4.35), ui_front (C53.2 S4.2)
PB1: ui_mcup (U4.36), ui_conn (P1.14)
PB2: ui_mcup (R38.2 U4.37), ui_front (C63.2 S14.2)
PB3: ui_mcup (U4.89), ui_conn (P4.6), ui_front (C52.2 S3.2)
PB4: ui_mcup (U4.90), ui_front (C67.1 E1.A)
PB5: ui_mcup (U4.91), ui_front (C68.1 E1.B)
PB6: ui_mcup (U4.92), ui_conn (R47.1)
PB7: ui_mcup (U4.93), ui_conn (R48.1)
PB8: ui_mcup (U4.95), ui_front (C51.2 S2.2)
PB9: ui_mcup (U4.96), ui_front (R36.2)
PB12: ui_mcup (U4.51), ui_front (R37.2)
PC0: ui_mcup (U4.15), ui_front (C54.2 S5.2)
PC1: ui_mcup (U4.16), ui_front (C55.2 S6.2)
PC4: ui_mcup (U4.33), ui_front (C56.2 S7.2)
PC5: ui_mcup (U4.34), ui_front (C57.2 S8.2)
PC6: ui_mcup (U4.63), ui_front (C73.1 E4.A)
PC7: ui_mcup (U4.64), ui_front (C74.1 E4.B)
PC8: ui_mcup (U4.65), ui_conn (P1.15)
PC13: ui_mcup (U4.7), ui_conn (P1.19), ui_front (C66.2 S17.2)
PC14: ui_mcup (U4.8), ui_front (C58.2 S9.2)
PC15: ui_mcup (U4.9), ui_front (C59.2 S10.2)
PD0: ui_mcup (U4.81), ui_front (L25.1)
PD1: ui_mcup (U4.82), ui_front (L26.1)
PD4: ui_mcup (U4.85), ui_front (L14.1)
PD5: ui_mcup (U4.86), ui_front (L13.1)
PD6: ui_mcup (U4.87), ui_front (C60.2 S11.2)
PD8: ui_mcup (U4.55), ui_front (L8.1)
PD9: ui_mcup (U4.56), ui_front (L9.1)
PD10: ui_mcup (U4.57), ui_front (L10.1)
PD11: ui_mcup (U4.58), ui_front (L12.1)
PD12: ui_mcup (U4.59), ui_front (C69.1 E2.A)
PD13: ui_mcup (U4.60), ui_front (C70.1 E2.B)
PD14: ui_mcup (U4.61), ui_front (L23.1)
PD15: ui_mcup (U4.62), ui_front (L24.1)
PE0: ui_mcup (U4.97), ui_conn (P1.12)
PE1: ui_mcup (U4.98), ui_conn (P1.13)
PE2: ui_mcup (U4.1), ui_front (C61.2 S12.2)
PE3: ui_mcup (U4.2), ui_front (C62.2 S13.2)
PE4: ui_mcup (U4.3), ui_front (C50.2 S1.2)
PE5: ui_mcup (U4.4), ui_front (C64.2 S15.2)
PE6: ui_mcup (U4.5), ui_front (C65.2 S16.2)
PE7: ui_mcup (U4.38), ui_front (L27.1)
PE8: ui_mcup (U4.39), ui_front (L28.1)
PE9: ui_mcup (U4.40), ui_front (L29.1)
PE10: ui_mcup (U4.41), ui_front (L30.1)
PE11: ui_mcup (U4.42), ui_front (L3.1)
PE12: ui_mcup (U4.43), ui_front (L4.1)
PE13: ui_mcup (U4.44), ui_front (L5.1)
PE14: ui_mcup (U4.45), ui_front (L6.1)
PE15: ui_mcup (U4.46), ui_front (L7.1)